# Altium schematic sheet JTAG ICE.SchDoc: JTAGICE
size A3; CheckedBy: Mohammad Sadr; Author: Mohammad Sadr; CompanyName: www.mElectronics.ir; DrawnBy: Mohammad Sadr; Engineer: Mohammad Sadr; Organization: Mohammad Sadr; Address1: Iran, Tehran; Address2: Shamsipour College (STVC); Address3: Electronic engineering; Address4: www.mElectronics.ir; DocumentNumber: 8.0; Revision: v 8.2; SheetNumber: 1; SheetTotal: 2; DocumentName: JTAGICE; ImagePath: Mohammad Sadr; ProjectName: JTAGICE
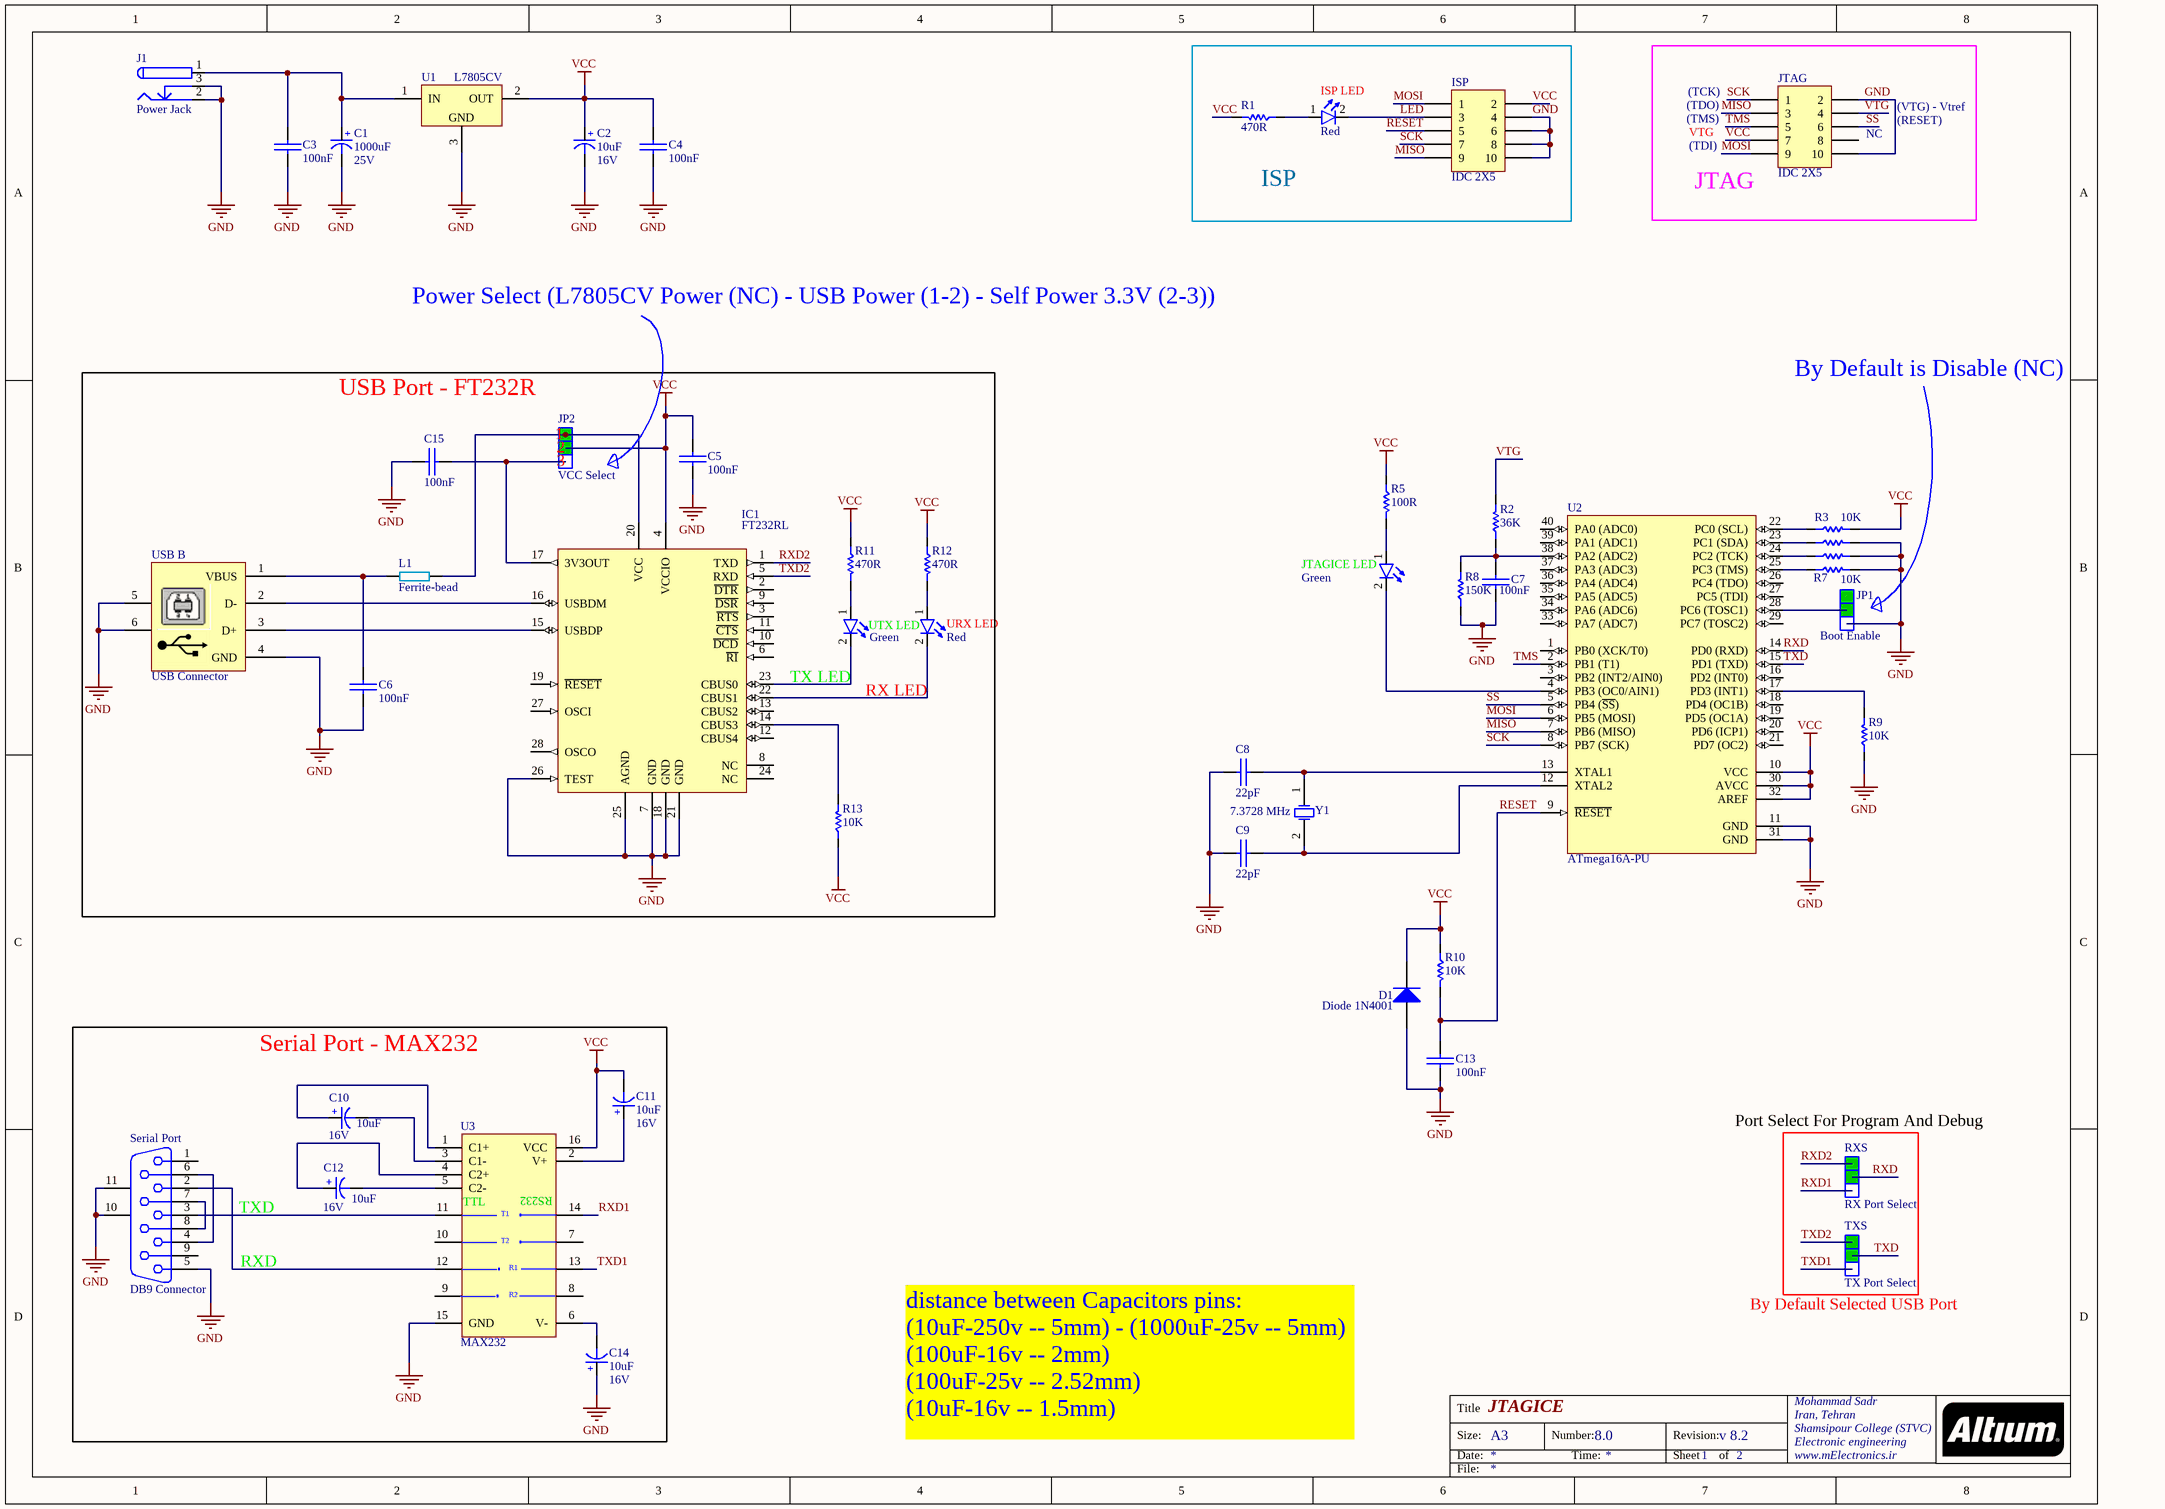
[diagram p0: JTAG ICE.SchDoc]

## Parts
C1  Voltage: 25V  [cap 04]  (hidden comment: 1000uF)
C2  Voltage: 16V  [cap 01]  (hidden comment: 10uF)
C3  100nF  [Cap - 100nF - 2]
C4  100nF  [Cap - 100nF - 2]
C5  100nF  [Cap - 100nF - 2]
C6  100nF  [Cap - 100nF - 2]
C7  100nF  [Cap - 100nF - 2]
C8  22pF  [Cap - 100nF - 2]
C9  22pF  [Cap - 100nF - 2]
C10  Voltage: 16V  [cap 01]  (hidden comment: 10uF)
C11  Voltage: 16V  [cap 01]  (hidden comment: 10uF)
C12  Voltage: 16V  [cap 01]  (hidden comment: 10uF)
C13  100nF  [Cap - 100nF - 2]
C14  Voltage: 16V  [cap 01]  (hidden comment: 10uF)
C15  100nF  [Cap - 100nF - 2]
D1  Diode 1N4001  [DO-41]
IC1  FT232RL  [SSOP-28_N]
ISP  IDC 2X5  [9181109621]
ISP_LED  Red  [LED-RED]
J1  Power Jack  [Power Jack]
JP1  Boot Enable  [jumper selector]
JP2  VCC Select  [jumper selector]
JTAG  IDC 2X5  [9181109621]
JTAGICE_LED  Green  [LED-GREEN]
L1  Ferrite-bead  [Ferrite-bead]
R1  470R  [Res-(1/4)]
R2  36K  [Res-(1/4)]
R3  10K  [Res-(1/4)]
R4  10K  [Res-(1/4)]  (value not drawn)
R5  100R  [Res-(1/4)]
R6  10K  [Res-(1/4)]  (value not drawn)
R7  10K  [Res-(1/4)]
R8  150K  [Res-(1/4)]
R9  10K  [Res-(1/4)]
R10  10K  [Res-(1/4)]
R11  470R  [Res-(1/4)]
R12  470R  [Res-(1/4)]
R13  10K  [Res-(1/4)]
RXS  RX Port Select  [jumper selector]
Serial_Port  DB9 Connector  [DB9 Female]
TXS  TX Port Select  [jumper selector]
U1  L7805CV  [78XXCV - Right]
U2  ATmega16A-PU  [40P6]
U3  MAX232  [DIP16]
URX_LED  Red  [LED-RED]
USB_B  USB Connector  [USB2.5-2H4E]
UTX_LED  Green  [LED-GREEN]
Y1  7.3728 MHz  [XTAL Small]

## Blocks framed on the sheet
ISP: ISP ISP_LED R1
JTAG: JTAG
USB Port - FT232R: C5 C6 C15 IC1 JP2 L1 R11-R13 URX_LED USB_B UTX_LED
Serial Port - MAX232: C10-C12 C14 Serial_Port U3

## Nets
GND: C1.2(-) C2.2(-) C3.2(-) C4.2(-) C5.2(-) C6.2(-) C7.2(-) C8.1(+) C9.1(+) C13.2(-) C14.1(+) C15.1(+) D1.1(A) IC1.7(GND) IC1.18(GND) IC1.21(GND) IC1.25(AGND) IC1.26(TEST) ISP.4 ISP.6 ISP.8 ISP.10 J1.2 J1.3 JP1.3 JTAG.2 JTAG.10 R4.2 R6.2 R7.2 R8.1 R9.1 Serial_Port.5 Serial_Port.10(MH1) Serial_Port.11(MH2) U1.3(GND) U2.11(GND) U2.31(GND) U3.15(GND) USB_B.4(GND) USB_B.5 USB_B.6
VCC: C2.1(+) C4.1(+) C5.1(+) C11.2(-) D1.2(K) IC1.4(VCCIO) ISP.2 JP2.2 JTAG.7 R1.2 R3.2 R5.1 R10.1 R11.1 R12.1 R13.1 U1.2(OUT) U2.10(VCC) U2.30(AVCC) U2.32(AREF) U3.16(VCC)
LED: ISP.3 ISP_LED.2(K)
MISO: ISP.9 JTAG.3 U2.7(PB6_(MISO))
MOSI: ISP.1 JTAG.9 U2.6(PB5_(MOSI))
RESET: C13.1(+) ISP.5 R10.2 U2.9(~{RESET})
RXD: RXS.2 U2.14(PD0_(RXD))
RXD1: RXS.3 U3.14(T1OUT)
RXD2: IC1.1(TXD) RXS.1
SCK: ISP.7 JTAG.1 U2.8(PB7_(SCK))
SS: JTAG.6 U2.5(PB4_(~{SS}))
TMS: JTAG.5 U2.2(PB1_(T1))
TXD: TXS.2 U2.15(PD1_(TXD))
TXD1: TXS.3 U3.13(R1IN)
TXD2: IC1.5(RXD) TXS.1
VTG: JTAG.4 R2.2
NetC1_1: C1.1(+) C3.1(+) J1.1 U1.1(IN)
NetC6_1: C6.1(+) L1.1 USB_B.1(VBUS)
NetC7_1: C7.1(+) R2.1 R8.2 U2.38(PA2_(ADC2))
NetC8_2: C8.2(-) U2.13(XTAL1) Y1.1(OSC1)
NetC9_2: C9.2(-) U2.12(XTAL2) Y1.2(OSC2)
NetC10_1: C10.1(+) U3.1(C1+)
NetC10_2: C10.2(-) U3.3(C1-)
NetC11_1: C11.1(+) U3.2(V+)
NetC12_1: C12.1(+) U3.4(C2+)
NetC12_2: C12.2(-) U3.5(C2-)
NetC14_2: C14.2(-) U3.6(V-)
NetC15_2: C15.2(-) IC1.17(3V3OUT) JP2.3
NetIC1_14: IC1.14(CBUS3) R13.2
NetIC1_15: IC1.15(USBDP) USB_B.3(D+)
NetIC1_16: IC1.16(USBDM) USB_B.2(D-)
NetIC1_20: IC1.20(VCC) JP2.1 L1.2
NetIC1_22: IC1.22(CBUS1) URX_LED.2(K)
NetIC1_23: IC1.23(CBUS0) UTX_LED.2(K)
NetISP_LED_1: ISP_LED.1(A) R1.1
NetJP1_2: JP1.2 U2.28(PC6_(TOSC1))
NetJTAGICE_LED_1: JTAGICE_LED.1(A) R5.2
NetJTAGICE_LED_2: JTAGICE_LED.2(K) U2.4(PB3_(OC0/AIN1))
NetR3_1: R3.1 U2.22(PC0_(SCL))
NetR4_1: R4.1 U2.23(PC1_(SDA))
NetR6_1: R6.1 U2.24(PC2_(TCK))
NetR7_1: R7.1 U2.25(PC3_(TMS))
NetR9_2: R9.2 U2.17(PD3_(INT1))
NetR11_2: R11.2 UTX_LED.1(A)
NetR12_2: R12.2 URX_LED.1(A)
NetSerial_Port_2: Serial_Port.2 U3.12(R1OUT)
NetSerial_Port_3: Serial_Port.3 U3.11(T1IN)
NetSerial_Port_4: Serial_Port.4 Serial_Port.6
NetSerial_Port_7: Serial_Port.7 Serial_Port.8

Not connected (* = marked no-connect by the designer): IC1 2(~{DTR}) 3(~{RTS}) 6(~{RI}) 8(NC) 9(~{DSR}) 10(~{DCD}) 11(~{CTS}) 12(CBUS4) 13(CBUS2) 19(~{RESET}) 24(NC) 27(OSCI) 28(OSCO); JP1 1; JTAG 8; Serial_Port 1 9; U2 1(PB0_(XCK/T0)) 3(PB2_(INT2/AIN0)) 16(PD2_(INT0)) 18(PD4_(OC1B)) 19(PD5_(OC1A)) 20(PD6_(ICP1)) 21(PD7_(OC2)) 26(PC4_(TDO)) 27(PC5_(TDI)) 29(PC7_(TOSC2)) 33(PA7_(ADC7)) 34(PA6_(ADC6)) 35(PA5_(ADC5)) 36(PA4_(ADC4)) 37(PA3_(ADC3)) 39(PA1_(ADC1)) 40(PA0_(ADC0)); U3 7(T2OUT) 8(R2IN) 9(R2OUT) 10(T2IN)

## Notes on the sheet
- (TDO)
- (TCK)
- (VTG) - Vtref
- (TMS)
- VTG
- (TDI)
- (near JTAG) NC
- (RESET)
- Power Select (L7805CV Power (NC) - USB Power (1-2) - Self Power 3.3V (2-3))
- By Default is Disable (NC)
- (near JP2) 1
- (near JP2) 2
- (near JP2) 3
- TX LED
- RX LED
- (near RXS) Port Select For Program And Debug
- TXD
- RXD
- (near TXS) By Default Selected USB Port
- distance between Capacitors pins:
  (10uF-250v -- 5mm) - (1000uF-25v -- 5mm)
  (100uF-16v -- 2mm)
  (100uF-25v -- 2.52mm)
  (10uF-16v -- 1.5mm)
- Title
- Size:
- Date:
- A3
- Number:
- Time:
- Revision:
- Sheet
- of
- File:
- (in symbol MAX232) TTL; RS232; T1; T2; R1; R2

## Library data of the parts
C1 C2 C10-C12 C14 = Cap-Polar: Polar Capacitor; Designer: Saeid Jorablo; Organazation: ControTec; Adding Date: 1387/12/20
  C1: Value: 1000uF
  C2 C10-C12 C14: Value: 10uF
C3-C9 C13 C15 = Cap-Bipolar: Bipolar Capacitor; Voltage: 100V; Designer: Saeid Jorablo; Organazation: ControTec; Adding Date: 1387/12/20
  C3-C7 C13 C15: Value: 100nF
  C8 C9: Value: 22pF
D1 = Diode 1N4001: 1 Amp General Purpose Rectifier; Published: 8-Jun-2000; LatestRevisionDate: 17-Jul-2002; LatestRevisionNote: Re-released for DXP Platform.; DatasheetVersion: 1998; PackageVersion: Aug-1999; PackageReference: DO-41; Publisher: Altium Limited; PackageDescription: Diode, Axial; Body 5.2 x 2.7 mm (LxDia. max), Lead Dia. 0.86 mm (max); Code_JEDEC: DO-204-AL; ComponentLink1Description: Manufacturer Link; ComponentLink1URL: http://www.fairchildsemi.com/; ComponentLink2Description: Datasheet; ComponentLink2URL: http://www.fairchildsemi.com/ds/1N%2F1N4001.pdf
IC1 = FT232RL: USB UART Asynchronous Serial Data Transfer Chip, SSOP-28, Tape and Reel; Published: 19-Aug-2010; DatasheetVersion: ver 2.07, Jul-2010; PackageVersion: 2010; PackageReference: SSOP-28; Publisher: Altium Limited; PackageDescription: 28-Pin Small Outline Package 0.65 mm Pitch; ComponentLink1Description: Manufacturer Link; ComponentLink1URL: http://www.ftdichip.com/Products/ICs/FT232R.htm; ComponentLink2Description: Datasheet; ComponentLink2URL: http://www.ftdichip.com/Support/Documents/DataSheets/ICs/DS_FT232R.pdf
ISP = Header 5X2: Header, 5-Pin, Dual row; LatestRevisionDate: 17-Jul-2002; LatestRevisionNote: Re-released for DXP Platform.; Publisher: Altium Limited
ISP_LED JTAGICE_LED URX_LED UTX_LED = LED: Designer: Saeid Jorablo; Organazation: ControTec; Adding Date: 1387/12/22; Size: SMD 1206
  ISP_LED URX_LED: Color: Red
  JTAGICE_LED UTX_LED: Color: Green
J1 = Power Jack: Designer: Saeid Jorablo; Company: Personal; Project Name: Laser; Adding Date: 10/21/2009
JP1 JP2 RXS TXS = Jumper Selector
JTAG = MHDR2X5: Header, 5-Pin, Dual row; LatestRevisionDate: 17-Jul-2002; LatestRevisionNote: Re-released for DXP Platform.; Publisher: Altium Limited
R1-R13 = Resistor: Tolerance: 5%; Power: 1/4 W
  R1 R11 R12: Value: 470R
  R2: Value: 36K
  R3 R4 R6 R7 R9 R10 R13: Value: 10K
  R5: Value: 100R
  R8: Value: 150K
Serial_Port = DB9 Connector: Receptacle Assembly, 9 Position, Right Angle; PackageDocument: O; Positions: 9; Published: 15-Jun-2001; LatestRevisionDate: 17-Jul-2002; LatestRevisionNote: Re-released for DXP Platform.; DatasheetDocument: 1-Sep-1999; PackageReference: 788750; Publisher: Altium Limited; Orientation: Right Angle; Gender: Receptacle
U1 = L78XXCV: Fixed Voltage Regulator; Designer: Saeid Jorablo; Company: ControTec; Adding Date: 1387/01/06; Voltage: *
U2 = ATmega16A-PU: 8-bit AVR Microcontroller, 16KB Flash, 512 Bytes EEPROM, 1KB SRAM, 40-pin PDIP, Industrial Grade (-40°C to 85°C); Published: 1-Apr-2010; DatasheetVersion: revB, Jul-2009; PackageVersion: revB, Sep-2001; PackageReference: 40P6; Publisher: Altium Limited; PackageDescription: 40-lead (0.600"/15.24mm Wide) Plastic Dual Inline Package (PDIP); Supplier 1: Digi-Key; Supplier Part Number 1: ATMEGA16A-PU-ND; Supplier 2: Farnell; Supplier Part Number 2: 1704561; Supplier 3: Mouser; Supplier Part Number 3: 556-ATMEGA16A-PU; Code_JEDEC: MS-011-AC; ComponentLink1Description: Manufacturer Link; ComponentLink1URL: http://www.atmel.com/products/avr/default.asp?; ComponentLink2Description: ATmega16A Datasheet; ComponentLink2URL: http://www.atmel.com/dyn/resources/prod_documents/doc8154.pdf; ComponentLink3Description: ATmega16A Summary; ComponentLink3URL: http://www.atmel.com/dyn/resources/prod_documents/8154S.pdf; ComponentLink4Description: Atmel.com Home; ComponentLink4URL: http://www.atmel.com
U3 = MAX232: +5V Powered, Multi-Channel RS-232 Driver/Receiver; ComponentAuthor: Saeid Jorablo; ComponentLink1Description: Datasheet; ComponentLink1URL: http://pdfserv.maxim-ic.com/en/ds/MAX220-MAX249.pdf
USB_B = USB: USB Connector-B Type; Designer: Eng. Saeid Jorablo; Company: DASE Co; Adding Date: 10/26/2010
Y1 = XTAL: XTAL Crystal; Company: E.P.I.L; Design Date: 11/04/2011; Value: 7.3728 MHz